# Altium schematic sheet pmodAdc1.SchDoc
size A4
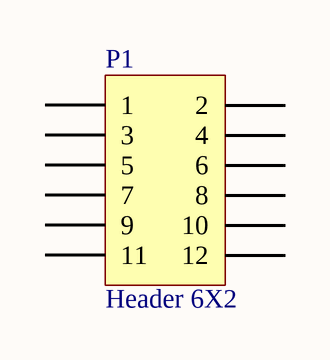
[diagram p0: pmodAdc1.SchDoc]

## Parts
P1  Header 6X2  [HDR2X6]

## Nets

Not connected (* = marked no-connect by the designer): P1 1 2 3 4 5 6 7 8 9 10 11 12

## Library data of the parts
P1 = Header 6X2: Header, 6-Pin, Dual row; LatestRevisionDate: 17-Jul-2002; LatestRevisionNote: Re-released for DXP Platform.; Publisher: Altium Limited